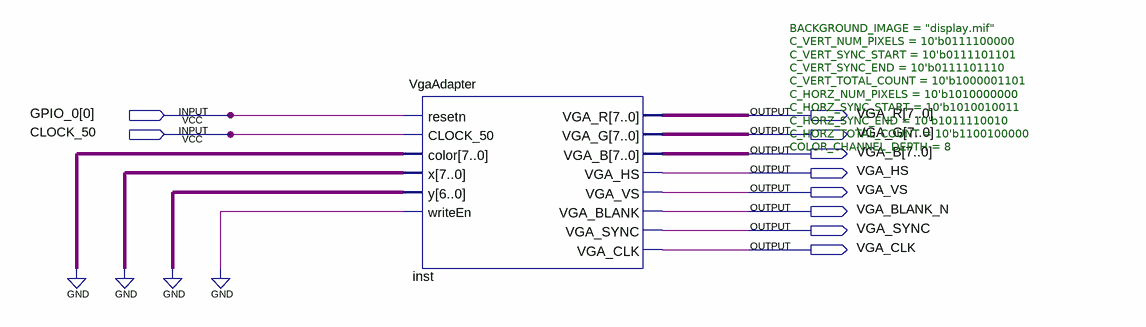
[diagram p0: schematic sheet]
// Quartus schematic DE2_TOP.bdf as structural Verilog: 1 symbols, 10 pins
module DE2_TOP (
  input  [0:0] GPIO_0,
  input  CLOCK_50,
  output [7:0] VGA_R,
  output [7:0] VGA_G,
  output [7:0] VGA_B,
  output VGA_HS,
  output VGA_VS,
  output VGA_BLANK_N,
  output VGA_SYNC,
  output VGA_CLK
);

  VgaAdapter #(.BACKGROUND_IMAGE("display.mif"), .C_VERT_NUM_PIXELS(10'b0111100000), .C_VERT_SYNC_START(10'b0111101101), .C_VERT_SYNC_END(10'b0111101110), .C_VERT_TOTAL_COUNT(10'b1000001101), .C_HORZ_NUM_PIXELS(10'b1010000000), .C_HORZ_SYNC_START(10'b1010010011), .C_HORZ_SYNC_END(10'b1011110010), .C_HORZ_TOTAL_COUNT(10'b1100100000), .COLOR_CHANNEL_DEPTH(8)) inst (
    .resetn(GPIO_0[0]), .CLOCK_50(CLOCK_50), .color({8{1'b0}}), .x({8{1'b0}}), .y({7{1'b0}}), .writeEn(1'b0),
    .VGA_R(VGA_R), .VGA_G(VGA_G), .VGA_B(VGA_B), .VGA_HS(VGA_HS), .VGA_VS(VGA_VS), .VGA_BLANK(VGA_BLANK_N),
    .VGA_SYNC(VGA_SYNC), .VGA_CLK(VGA_CLK));
endmodule
